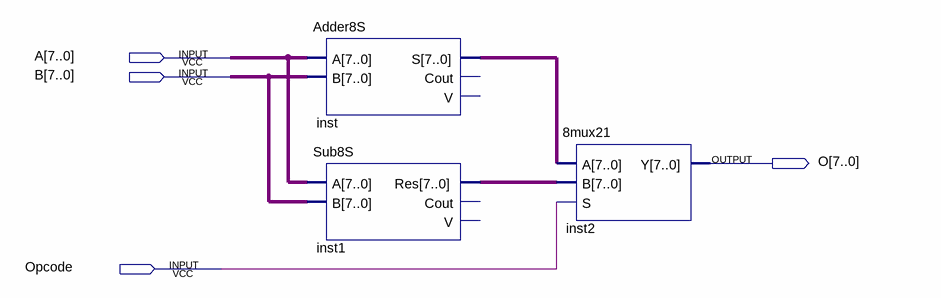
[diagram p0: schematic sheet]
// Quartus schematic AU.bdf as structural Verilog: 3 symbols, 4 pins
module AU (
  input  [7:0] A,
  input  [7:0] B,
  input  Opcode,
  output [7:0] O
);

  wire [7:0] inst1_res, inst_s;

  Adder8S inst (.A(A), .B(B), .S(inst_s));  // open: Cout, V
  Sub8S inst1 (.A(A), .B(B), .Res(inst1_res));  // open: Cout, V
  \8mux21  inst2 (.A(inst_s), .B(inst1_res), .S(Opcode), .Y(O));
endmodule
